# EAGLE design board-cube (EAGLE 6.6.0)
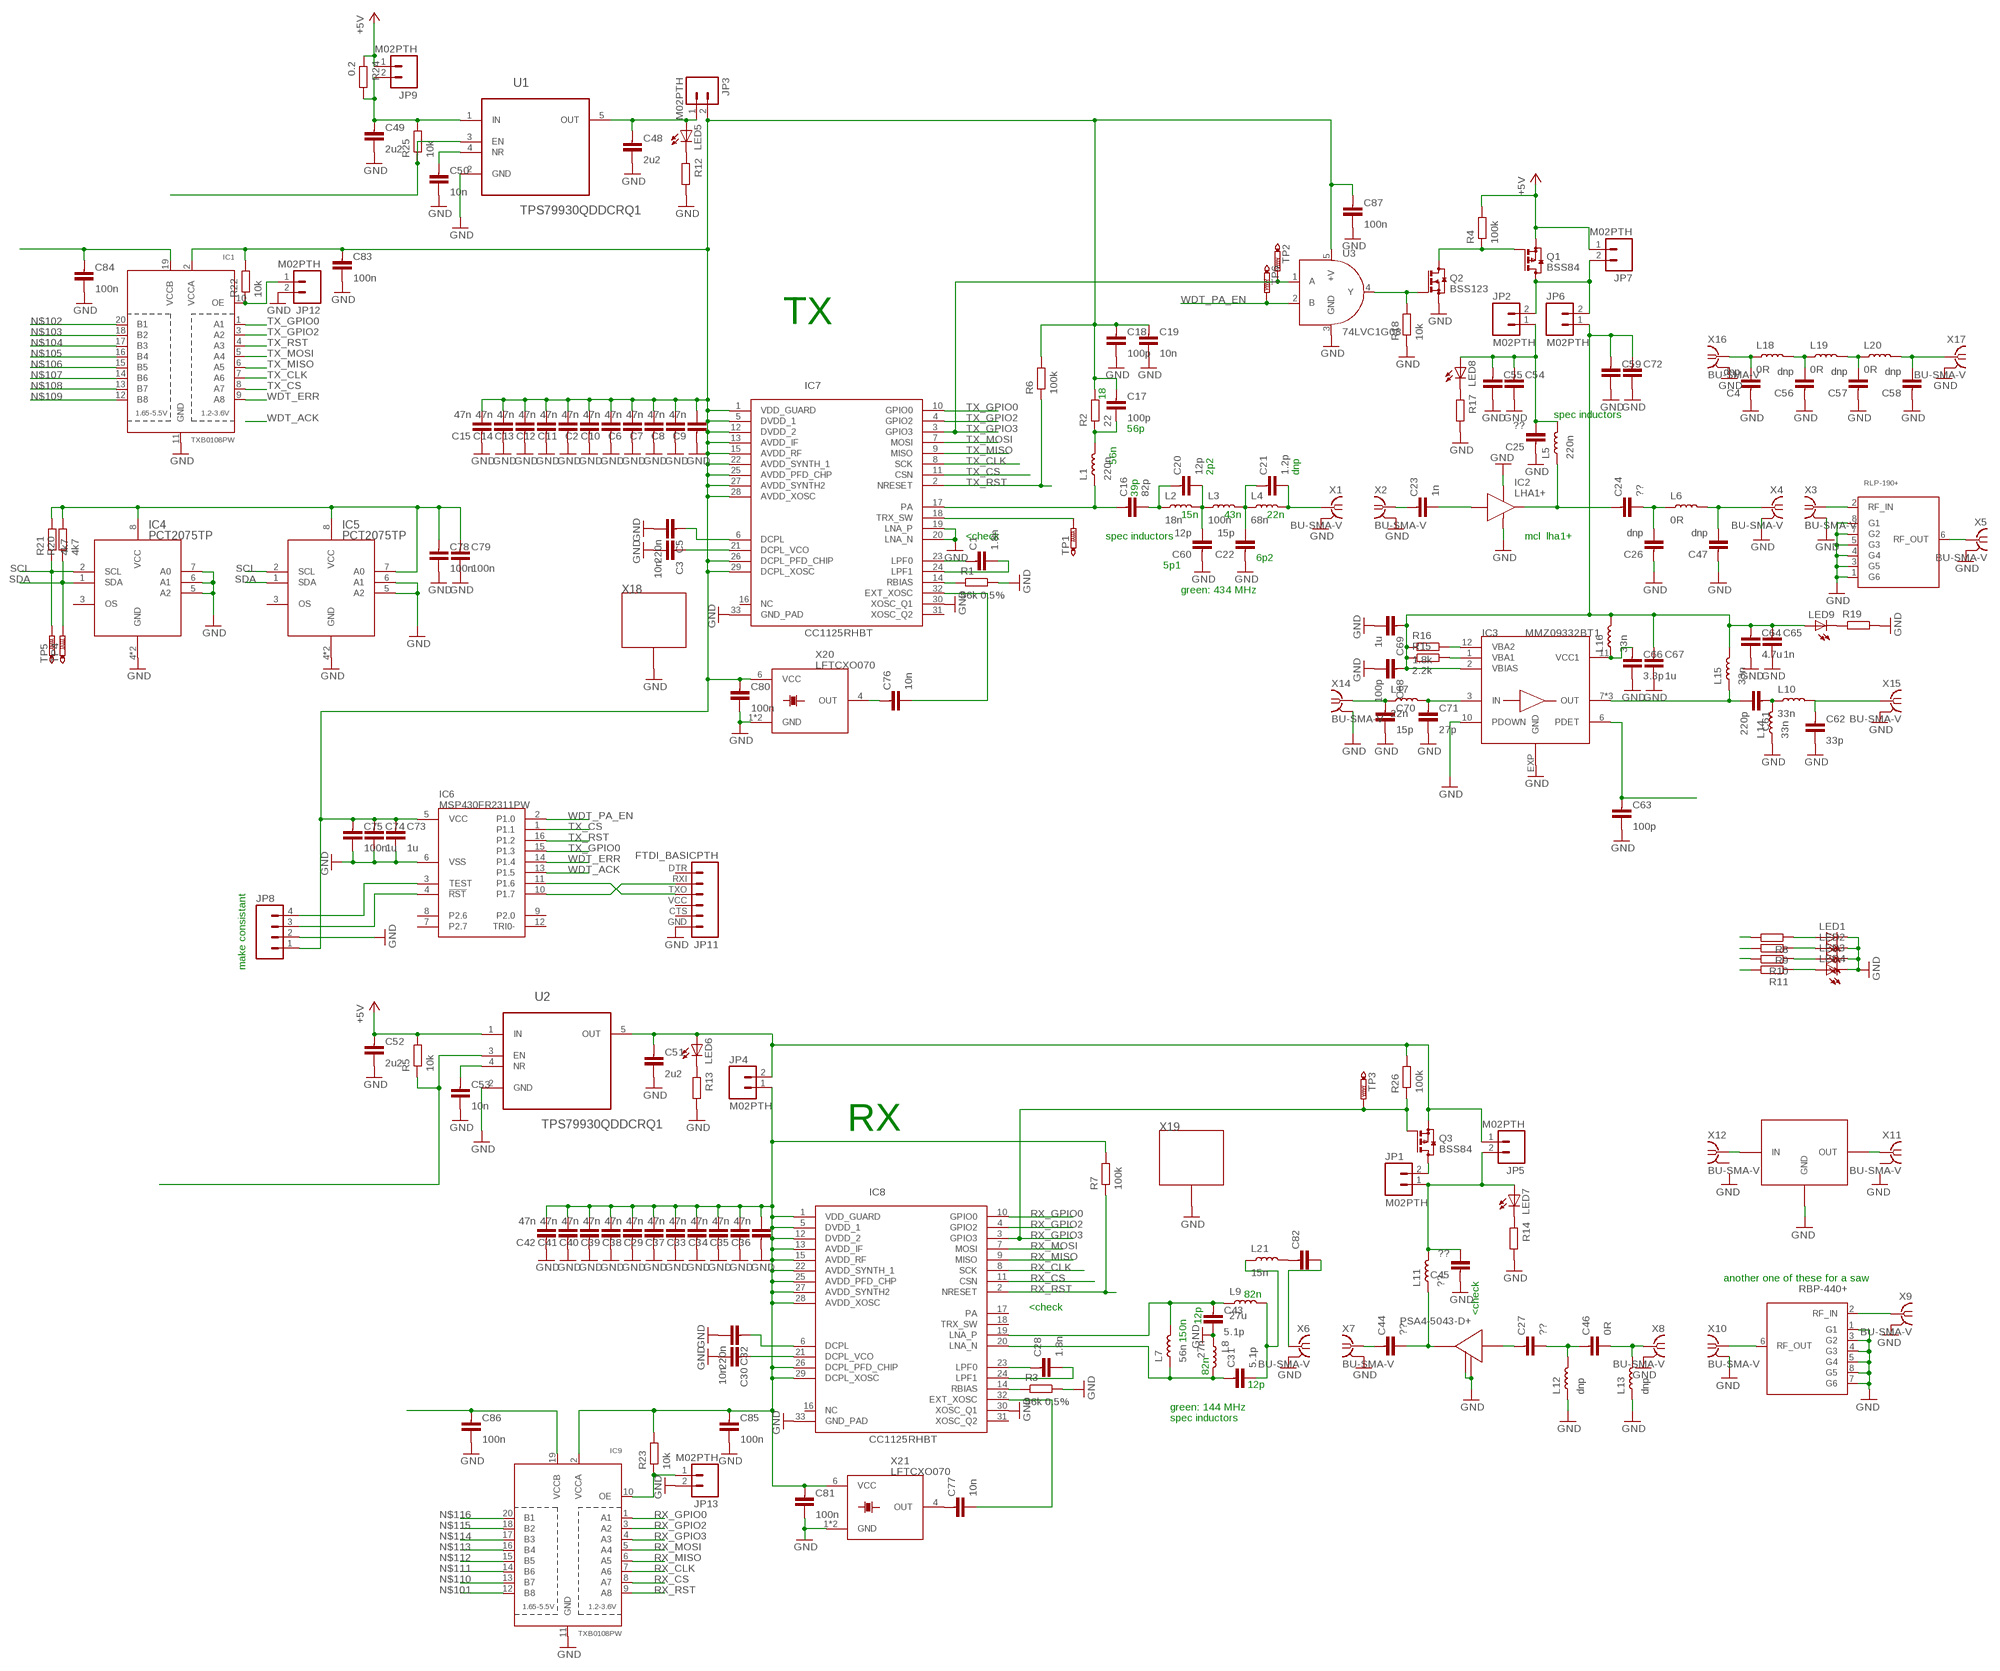
[diagram p0: schematic, sheet 1]

## Parts
C1  1.8n  CAPACITOR0603-N  [C0603-N]
C2  47n  CAPACITOR0603-N  [C0603-N]
C3  10n  CAPACITOR0603-N  [C0603-N]
C4  dnp  CAPACITOR0603-N  [C0603-N]
C5  220n  CAPACITOR0603-N  [C0603-N]
C6  47n  CAPACITOR0603-N  [C0603-N]
C7  47n  CAPACITOR0603-N  [C0603-N]
C8  47n  CAPACITOR0603-N  [C0603-N]
C9  47n  CAPACITOR0603-N  [C0603-N]
C10  47n  CAPACITOR0603-N  [C0603-N]
C11  47n  CAPACITOR0603-N  [C0603-N]
C12  47n  CAPACITOR0603-N  [C0603-N]
C13  47n  CAPACITOR0603-N  [C0603-N]
C14  47n  CAPACITOR0603-N  [C0603-N]
C15  47n  CAPACITOR0603-N  [C0603-N]
C16  82p  CAPACITOR0603-N  [C0603-N]
C17  100p  CAPACITOR0603-N  [C0603-N]
C18  100p  CAPACITOR0603-N  [C0603-N]
C19  10n  CAPACITOR0603-N  [C0603-N]
C20  12p  CAPACITOR0603-N  [C0603-N]
C21  1.2p  CAPACITOR0603-N  [C0603-N]
C22  15p  CAPACITOR0603-N  [C0603-N]
C23  1n  CAPACITOR0603-N  [C0603-N]
C24  ??  CAPACITOR0603-N  [C0603-N]
C25  ??  CAPACITOR0603-N  [C0603-N]
C26  dnp  CAPACITOR0603-N  [C0603-N]
C27  ??  CAPACITOR0603-N  [C0603-N]
C28  1.8n  CAPACITOR0603-N  [C0603-N]
C29  47n  CAPACITOR0603-N  [C0603-N]
C30  10n  CAPACITOR0603-N  [C0603-N]
C31  5.1p  CAPACITOR0603-N  [C0603-N]
C32  220n  CAPACITOR0603-N  [C0603-N]
C33  47n  CAPACITOR0603-N  [C0603-N]
C34  47n  CAPACITOR0603-N  [C0603-N]
C35  47n  CAPACITOR0603-N  [C0603-N]
C36  47n  CAPACITOR0603-N  [C0603-N]
C37  47n  CAPACITOR0603-N  [C0603-N]
C38  47n  CAPACITOR0603-N  [C0603-N]
C39  47n  CAPACITOR0603-N  [C0603-N]
C40  47n  CAPACITOR0603-N  [C0603-N]
C41  47n  CAPACITOR0603-N  [C0603-N]
C42  47n  CAPACITOR0603-N  [C0603-N]
C43  5.1p  CAPACITOR0603-N  [C0603-N]
C44  ??  CAPACITOR0603-N  [C0603-N]
C45  ??  CAPACITOR0603-N  [C0603-N]
C46  0R  CAPACITOR0603-N  [C0603-N]
C47  dnp  CAPACITOR0603-N  [C0603-N]
C48  2u2  CAPACITOR0603-N  [C0603-N]
C49  2u2  CAPACITOR0603-N  [C0603-N]
C50  10n  CAPACITOR0603-N  [C0603-N]
C51  2u2  CAPACITOR0603-N  [C0603-N]
C52  2u2  CAPACITOR0603-N  [C0603-N]
C53  10n  CAPACITOR0603-N  [C0603-N]
C54  CAPACITOR0805-N  [C0805-N]
C55  CAPACITOR0805-N  [C0805-N]
C56  dnp  CAPACITOR0603-N  [C0603-N]
C57  dnp  CAPACITOR0603-N  [C0603-N]
C58  dnp  CAPACITOR0603-N  [C0603-N]
C59  CAPACITOR0805-N  [C0805-N]
C60  12p  CAPACITOR0603-N  [C0603-N]
C61  220p  CAPACITOR0603-N  [C0603-N]
C62  33p  CAPACITOR0603-N  [C0603-N]
C63  100p  CAPACITOR0603-N  [C0603-N]
C64  4.7u  CAPACITOR0603-N  [C0603-N]
C65  1n  CAPACITOR0603-N  [C0603-N]
C66  3.3p  CAPACITOR0603-N  [C0603-N]
C67  1u  CAPACITOR0603-N  [C0603-N]
C68  100p  CAPACITOR0603-N  [C0603-N]
C69  1u  CAPACITOR0603-N  [C0603-N]
C70  15p  CAPACITOR0603-N  [C0603-N]
C71  27p  CAPACITOR0603-N  [C0603-N]
C72  CAPACITOR0805-N  [C0805-N]
C73  1u  CAPACITOR0603-N  [C0603-N]
C74  1u  CAPACITOR0603-N  [C0603-N]
C75  100n  CAPACITOR0603-N  [C0603-N]
C76  10n  CAPACITOR0603-N  [C0603-N]
C77  10n  CAPACITOR0603-N  [C0603-N]
C78  100n  CAPACITOR0603-N  [C0603-N]
C79  100n  CAPACITOR0603-N  [C0603-N]
C80  100n  CAPACITOR0603-N  [C0603-N]
C81  100n  CAPACITOR0603-N  [C0603-N]
C82  CAPACITOR0603-N  [C0603-N]
C83  100n  CAPACITOR0603-N  [C0603-N]
C84  100n  CAPACITOR0603-N  [C0603-N]
C85  100n  CAPACITOR0603-N  [C0603-N]
C86  100n  CAPACITOR0603-N  [C0603-N]
C87  100n  CAPACITOR0603-N  [C0603-N]
FL1  LPF_CS  [PL-176]
FL2  SAW_FILTER_CS  [PL-176]
FL3  GOLLEDGE_SAW_FILTER  [GOLLEDGE_SAW]
IC1  TXB0108PW  [TSSOP20]
IC2  LHA1+  PA  [PA]
IC3  MMZ09332BT1  [QFN3X3-6]
IC4  PCT2075TP  [HWSON8]
IC5  PCT2075TP  [HWSON8]
IC6  MSP430FR2311PW  [SSOP16]
IC7  CC1125RHBT  [QFN32_5X5]
IC8  CC1125RHBT  [QFN32_5X5]
IC9  TXB0108PW  [TSSOP20]
IC10  LNA_COMMON  [LNA_MMM1362]
JP1  M02PTH  [1X02]
JP2  M02PTH  [1X02]
JP3  M02PTH  [1X02]
JP4  M02PTH  [1X02]
JP5  M02PTH  [1X02]
JP6  M02PTH  [1X02]
JP7  M02PTH  [1X02]
JP8  M04PTH  [1X04]
JP9  M02PTH  [1X02]
JP11  FTDI_BASICPTH  [FTDI_BASIC]
JP12  M02PTH  [1X02]
JP13  M02PTH  [1X02]
L1  220n  INDUCTOR0603-N  [L0603-N]
L2  18n  INDUCTOR0603-N  [L0603-N]
L3  100n  INDUCTOR0603-N  [L0603-N]
L4  68n  INDUCTOR0603-N  [L0603-N]
L5  220n  INDUCTOR0603-N  [L0603-N]
L6  0R  INDUCTOR0603-N  [L0603-N]
L7  56n  INDUCTOR0603-N  [L0603-N]
L8  27n  INDUCTOR0603-N  [L0603-N]
L9  27u  INDUCTOR0603-N  [L0603-N]
L10  33n  INDUCTOR0603-N  [L0603-N]
L11  ??  INDUCTOR0603-N  [L0603-N]
L12  dnp  INDUCTOR0603-N  [L0603-N]
L13  dnp  INDUCTOR0603-N  [L0603-N]
L14  33n  INDUCTOR0603-N  [L0603-N]
L15  33n  INDUCTOR0603-N  [L0603-N]
L16  33n  INDUCTOR0603-N  [L0603-N]
L17  22n  INDUCTOR0603-N  [L0603-N]
L18  0R  INDUCTOR0603-N  [L0603-N]
L19  0R  INDUCTOR0603-N  [L0603-N]
L20  0R  INDUCTOR0603-N  [L0603-N]
L21  15n  INDUCTOR0603-N  [L0603-N]
LED1  LEDCHIP-LED0603  [CHIP-LED0603]
LED2  LEDCHIP-LED0603  [CHIP-LED0603]
LED3  LEDCHIP-LED0603  [CHIP-LED0603]
LED4  LEDCHIP-LED0603  [CHIP-LED0603]
LED5  LEDCHIP-LED0603  [CHIP-LED0603]
LED6  LEDCHIP-LED0603  [CHIP-LED0603]
LED7  LEDCHIP-LED0603  [CHIP-LED0603]
LED8  LEDCHIP-LED0603  [CHIP-LED0603]
LED9  LEDCHIP-LED0603  [CHIP-LED0603]
Q1  BSS84  [SOT23]
Q2  BSS123  [SOT23]
Q3  BSS84  [SOT23]
R1  56k 0.5%  RESISTOR0603-N  [R0603-N]
R2  22  RESISTOR0603-N  [R0603-N]
R3  56k 0.5%  RESISTOR0603-N  [R0603-N]
R4  100k  RESISTOR0603-N  [R0603-N]
R5  10k  RESISTOR0603-N  [R0603-N]
R6  100k  RESISTOR0603-N  [R0603-N]
R7  100k  RESISTOR0603-N  [R0603-N]
R8  RESISTOR0603-N  [R0603-N]
R9  RESISTOR0603-N  [R0603-N]
R10  RESISTOR0603-N  [R0603-N]
R11  RESISTOR0603-N  [R0603-N]
R12  RESISTOR0603-N  [R0603-N]
R13  RESISTOR0603-N  [R0603-N]
R14  RESISTOR0603-N  [R0603-N]
R15  2.2k  RESISTOR0603-N  [R0603-N]
R16  1.8k  RESISTOR0603-N  [R0603-N]
R17  RESISTOR0603-N  [R0603-N]
R18  10k  RESISTOR0603-N  [R0603-N]
R19  RESISTOR0603-N  [R0603-N]
R20  4k7  RESISTOR0603-N  [R0603-N]
R21  4k7  RESISTOR0603-N  [R0603-N]
R22  10k  RESISTOR0603-N  [R0603-N]
R23  10k  RESISTOR0603-N  [R0603-N]
R24  0.2  RESISTOR0603-N  [R0603-N]
R25  10k  RESISTOR0603-N  [R0603-N]
R26  100k  RESISTOR0603-N  [R0603-N]
TP1  PTR1B1,27  [B1,27]
TP2  PTR1B1,27  [B1,27]
TP3  PTR1B1,27  [B1,27]
TP4  PTR1B1,27  [B1,27]
TP5  PTR1B1,27  [B1,27]
TP6  PTR1B1,27  [B1,27]
U1  TPS79930QDDCRQ1  TPS79933QDDCRQ1  [SOT95P280X110-5N]
U2  TPS79930QDDCRQ1  TPS79933QDDCRQ1  [SOT95P280X110-5N]
U3  74LVC1G08  SN74LVC1G08  [SOT23-5]
X1  BU-SMA-V  [BU-SMA-V]
X2  BU-SMA-V  [BU-SMA-V]
X3  BU-SMA-V  [BU-SMA-V]
X4  BU-SMA-V  [BU-SMA-V]
X5  BU-SMA-V  [BU-SMA-V]
X6  BU-SMA-V  [BU-SMA-V]
X7  BU-SMA-V  [BU-SMA-V]
X8  BU-SMA-V  [BU-SMA-V]
X9  BU-SMA-V  [BU-SMA-V]
X10  BU-SMA-V  [BU-SMA-V]
X11  BU-SMA-V  [BU-SMA-V]
X12  BU-SMA-V  [BU-SMA-V]
X14  BU-SMA-V  [BU-SMA-V]
X15  BU-SMA-V  [BU-SMA-V]
X16  BU-SMA-V  [BU-SMA-V]
X17  BU-SMA-V  [BU-SMA-V]
X18  SHIELD-26X26  [SHIELD-26X26]
X19  SHIELD-26X26  [SHIELD-26X26]
X20  LFTCXO070  [260-SERIES]
X21  LFTCXO070  [260-SERIES]

## Nets
+5V: C52.1 JP7.1 JP9.1 Q1.2(S) R4.2 R5.2 R24.1 U2.1(IN)
GND: C2.1 C3.2 C4.1 C5.2 C6.1 C7.1 C8.1 C9.1 C10.1 C11.1 C12.1 C13.1 C14.1 C15.1 C18.2 C19.2 C22.1 C25.1 C26.1 C29.1 C30.2 C32.2 C33.1 C34.1 C35.1 C36.1 C37.1 C38.1 C39.1 C40.1 C41.1 C42.1 C43.2 C45.1 C47.1 C48.2 C49.2 C50.2 C51.2 C52.2 C53.2 C54.2 C55.2 C56.1 C57.1 C58.1 C59.2 C60.1 C62.2 C63.2 C64.2 C65.2 C66.2 C67.2 C68.2 C69.2 C70.2 C71.2 C72.2 C73.2 C74.2 C75.2 C78.2 C79.2 C80.2 C81.2 C83.2 C84.2 C85.2 C86.2 C87.2 FL1.1(G6) FL1.3(G5) FL1.4(G4) FL1.5(G3) FL1.7(G2) FL1.8(G1) FL2.1(G1) FL2.3(G2) FL2.4(G3) FL2.5(G4) FL2.7(G6) FL2.8(G5) FL3.A(GND) FL3.C(GND) FL3.D(GND) FL3.F(GND) IC1.11(GND) IC2.GND1 IC2.GND2 IC3.10(PDOWN) IC3.EXP(GND) IC4.4(GND) IC4.5(A2) IC4.6(A1) IC4.7(A0) IC4.EP(GND) IC5.4(GND) IC5.5(A2) IC5.6(A1) IC5.EP(GND) IC6.6(VSS) IC7.19(LNA_P) IC7.20(LNA_N) IC7.30(XOSC_Q1) IC7.33(GND_PAD) IC8.30(XOSC_Q1) IC8.33(GND_PAD) IC9.11(GND) IC10.2 IC10.4 JP8.2 JP11.GND JP12.2 JP13.2 L8.1 L12.1 L13.1 L14.1 LED1.C LED2.C LED3.C LED4.C Q2.2(S) R1.2 R3.2 R12.2 R13.2 R14.2 R17.2 R18.1 R19.2 U1.2(GND) U2.2(GND) U3.3(GND) X1.2 X1.3 X1.4 X1.5 X2.2 X2.3 X2.4 X2.5 X3.2 X3.3 X3.4 X3.5 X4.2 X4.3 X4.4 X4.5 X5.2 X5.3 X5.4 X5.5 X6.2 X6.3 X6.4 X6.5 X7.2 X7.3 X7.4 X7.5 X8.2 X8.3 X8.4 X8.5 X9.2 X9.3 X9.4 X9.5 X10.2 X10.3 X10.4 X10.5 X14.2 X14.3 X14.4 X14.5 X15.2 X15.3 X15.4 X15.5 X16.2 X16.3 X16.4 X16.5 X17.2 X17.3 X17.4 X17.5 X18.G1(G) X18.G2(G) X18.G3(G) X18.G4(G) X18.G5(G) X18.G6(G) X18.G7(G) X18.G8(G) X18.G9(G) X18.G10(G) X18.G11(G) X18.G12(G) X18.G13(G) X18.G14(G) X18.G15(G) X18.G16(G) X18.G17(G) X18.G19(G) X18.G20(G) X18.G21(G) X19.G1(G) X19.G2(G) X19.G3(G) X19.G4(G) X19.G5(G) X19.G6(G) X19.G7(G) X19.G8(G) X19.G9(G) X19.G10(G) X19.G11(G) X19.G12(G) X19.G13(G) X19.G14(G) X19.G15(G) X19.G16(G) X19.G17(G) X19.G19(G) X19.G20(G) X19.G21(G) X20.1(GND) X20.3(GND) X21.1(GND) X21.3(GND)
N$1: C1.1 IC7.23(LPF0)
N$2: C1.2 IC7.24(LPF1)
N$3: C23.2 IC2.RF_IN
N$4: C3.1 IC7.21(DCPL_VCO)
N$5: C17.2 L1.2 R2.1
N$6: JP2.2 JP6.2 JP7.2 Q1.3(D)
N$7: C16.1 IC7.17(PA) L1.1
N$8: IC7.14(RBIAS) R1.1
N$9: C76.2 IC7.32(EXT_XOSC)
N$10: LED1.A R8.1
N$11: LED2.A R9.1
N$12: LED3.A R10.1
N$13: IC7.18(TRX_SW) TP1.TP
N$14: LED4.A R11.1
N$15: R11.2
N$16: C4.2 L18.1 X16.1
N$17: R10.2
N$18: C24.1 IC2.RF_OUT L5.1
N$19: C5.1 IC7.6(DCPL)
N$20: C16.2 C20.1 L2.1
N$21: C20.2 C60.2 L2.2 L3.1
N$22: C21.1 C22.2 L3.2 L4.1
N$23: C21.2 L4.2 X1.1
N$24: C59.1 C64.1 C65.1 C67.1 C68.1 C69.1 C72.1 IC3.2(VBIAS) JP6.1 L15.2 L16.2 LED9.A R15.1 R16.1
N$25: C24.2 C26.2 L6.1
N$26: C23.1 X2.1
N$27: C47.2 L6.2 X4.1
N$28: FL1.2(RF_IN) X3.1
N$29: FL1.6(RF_OUT) X5.1
N$30: C28.1 IC8.23(LPF0)
N$31: C28.2 IC8.24(LPF1)
N$32: C30.1 IC8.21(DCPL_VCO)
N$33: C44.1 X7.1
N$34: C44.2 IC10.1(RF_OUT) L11.1
N$35: IC8.14(RBIAS) R3.1
N$36: C77.2 IC8.32(EXT_XOSC)
N$37: R9.2
N$38: R8.2
N$39: C48.1 JP3.1 LED5.A U1.5(OUT)
N$40: LED5.C R12.1
N$41: LED6.C R13.1
N$42: LED7.C R14.1
N$43: FL3.E(OUT) X11.1
N$44: FL3.B(IN) X12.1
N$45: C32.1 IC8.6(DCPL)
N$46: C27.1 IC10.3(RF_IN)
N$47: C43.1 IC8.19(LNA_P) L7.2 L9.1
N$48: C31.1 IC8.20(LNA_N) L7.1 L8.2
N$49: C82.2 X6.1
N$50: C27.2 C46.1 L12.2
N$51: C2.2 C6.2 C7.2 C8.2 C9.2 C10.2 C11.2 C12.2 C13.2 C14.2 C15.2 C17.1 C18.1 C19.1 C73.1 C74.1 C75.1 C80.1 C83.1 C87.1 IC1.2(VCCA) IC6.5(VCC) IC7.1(VDD_GUARD) IC7.5(DVDD_1) IC7.12(DVDD_2) IC7.13(AVDD_IF) IC7.15(AVDD_RF) IC7.22(AVDD_SYNTH_1) IC7.25(AVDD_PFD_CHP) IC7.26(DCPL_PFD_CHIP) IC7.27(AVDD_SYNTH2) IC7.28(AVDD_XOSC) IC7.29(DCPL_XOSC) JP3.2 JP8.1 R2.2 R6.2 R22.2 U3.5(+V) X20.6(VCC)
N$52: C45.2 JP1.1 JP5.2 L11.2 LED7.A
N$53: JP4.2 JP5.1 LED6.A Q3.2(S) R26.2
N$54: C46.2 L13.2 X8.1
N$55: FL2.2(RF_IN) X9.1
N$56: FL2.6(RF_OUT) X10.1
N$57: C50.1 U1.4(NR)
N$58: C61.1 L10.1 L14.2
N$59: C51.1 U2.5(OUT)
N$60: C53.1 U2.4(NR)
N$61: R5.1 U2.3(EN)
N$62: Q1.1(G) Q2.3(D) R4.1
N$63: C29.2 C33.2 C34.2 C35.2 C36.2 C37.2 C38.2 C39.2 C40.2 C41.2 C42.2 C81.1 C85.1 IC8.1(VDD_GUARD) IC8.5(DVDD_1) IC8.12(DVDD_2) IC8.13(AVDD_IF) IC8.15(AVDD_RF) IC8.22(AVDD_SYNTH_1) IC8.25(AVDD_PFD_CHP) IC8.26(DCPL_PFD_CHIP) IC8.27(AVDD_SYNTH2) IC8.28(AVDD_XOSC) IC8.29(DCPL_XOSC) IC9.2(VCCA) JP4.1 R7.2 R23.2 X21.6(VCC)
N$64: C61.2 IC3.7(OUT) IC3.8(OUT) IC3.9(OUT) L15.1
N$65: C62.1 L10.2 X15.1
N$66: C63.1 IC3.6(PDET)
N$67: LED8.C R17.1
N$68: C66.1 IC3.11(VCC1) L16.1
N$69: C49.1 JP9.2 R24.2 R25.2 U1.1(IN)
N$70: IC3.12(VBA2) R16.2
N$71: IC3.1(VBA1) R15.2
N$72: LED9.C R19.1
N$73: C70.1 L17.1 X14.1
N$74: C71.1 IC3.3(IN) L17.2
N$75: JP1.2 Q3.3(D)
N$76: C56.2 L18.2 L19.1
N$77: C57.2 L19.2 L20.1
N$78: C58.2 L20.2 X17.1
N$79: C25.2 C54.1 C55.1 JP2.1 L5.2 LED8.A
N$80: IC1.10(OE) JP12.1 R22.1
N$81: C76.1 X20.4(OUT)
N$82: C77.1 X21.4(OUT)
N$83: IC6.3(TEST) JP8.4
N$84: IC6.4(!RST) JP8.3
N$85: IC6.11(P1.6) JP11.TXO
N$86: C78.1 C79.1 IC4.8(VCC) IC5.7(A0) IC5.8(VCC) R20.2 R21.2
N$87: IC6.10(P1.7) JP11.RXI
N$88: C82.1 L21.2
N$90: C31.2 L9.2 L21.1
N$91: IC9.10(OE) JP13.1 R23.1
N$92: C84.1 IC1.19(VCCB)
N$93: C86.1 IC9.19(VCCB)
N$94: R25.1 U1.3(EN)
N$101: IC9.12(B8)
N$102: IC1.20(B1)
N$103: IC1.18(B2)
N$104: IC1.17(B3)
N$105: IC1.16(B4)
N$106: IC1.15(B5)
N$107: IC1.14(B6)
N$108: IC1.13(B7)
N$109: IC1.12(B8)
N$110: IC9.13(B7)
N$111: IC9.14(B6)
N$112: IC9.15(B5)
N$113: IC9.16(B4)
N$114: IC9.17(B3)
N$115: IC9.18(B2)
N$116: IC9.20(B1)
N$117: Q2.1(G) R18.2 U3.4(Y)
RX_CLK: IC8.8(SCK) IC9.7(A6)
RX_CS: IC8.11(CSN) IC9.8(A7)
RX_GPIO0: IC8.10(GPIO0) IC9.1(A1)
RX_GPIO2: IC8.4(GPIO2) IC9.3(A2)
RX_GPIO3: IC8.3(GPIO3) IC9.4(A3) Q3.1(G) R26.1 TP3.TP
RX_MISO: IC8.9(MISO) IC9.6(A5)
RX_MOSI: IC8.7(MOSI) IC9.5(A4)
RX_RST: IC8.2(NRESET) IC9.9(A8) R7.1
SCL: IC4.2(SCL) IC5.2(SCL) R21.1 TP5.TP
SDA: IC4.1(SDA) IC5.1(SDA) R20.1 TP4.TP
TX_CLK: IC1.7(A6) IC7.8(SCK)
TX_CS: IC1.8(A7) IC6.1(P1.1) IC7.11(CSN)
TX_GPIO0: IC1.1(A1) IC6.15(P1.3) IC7.10(GPIO0)
TX_GPIO2: IC1.3(A2) IC7.4(GPIO2)
TX_GPIO3: IC7.3(GPIO3) TP2.TP U3.1(A)
TX_MISO: IC1.6(A5) IC7.9(MISO)
TX_MOSI: IC1.5(A4) IC7.7(MOSI)
TX_RST: IC1.4(A3) IC6.16(P1.2) IC7.2(NRESET) R6.1
WDT_ACK: IC6.13(P1.5)
WDT_ERR: IC1.9(A8) IC6.14(P1.4)
WDT_PA_EN: IC6.2(P1.0) TP6.TP U3.2(B)
Unconnected: IC4.3(OS) IC5.3(OS) IC6.7(P2.7) IC6.8(P2.6) IC6.9(P2.0) IC6.12(TRI0-) IC7.16(NC) IC7.31(XOSC_Q2) IC8.16(NC) IC8.17(PA) IC8.18(TRX_SW) IC8.31(XOSC_Q2) JP11.CTS JP11.DTR JP11.VCC X11.2 X11.3 X11.4 X11.5 X12.2 X12.3 X12.4 X12.5

## Notes on the sheet
- TX
- 18
- spec inductors
- 56p
- 56n
- 2p2 | dnp
- 39p
- 15n | 43n | 22n
- <check | spec inductors | mcl  lha1+
- 5p1 | 6p2
- green: 434 MHz
- make consistant
- RX
- <check | another one of these for a saw
- 82n
- <check
- 12p
- 150n
- 82n
- 12p
- green: 144 MHz
- spec inductors

## Library data of the parts
C1-C87 = passives-7351:CAPACITOR
FL1 = CubeSat3:LPF_CS
FL2 = CubeSat3:SAW_FILTER_CS
FL3 = Ava:GOLLEDGE_SAW_FILTER
IC1 IC9 = cube-parts:TXB0108
IC2 = CubeSat3:PA
IC3 = CubeSat3:MMZ09332BT1
IC4 IC5 = CubeSat3:PCT2075; FARNELL: 2396745
IC6 = CubeSat3:MSP430FR2311
IC7 IC8 = cube-parts:CC1125RHBT; FARNELL_OC: 2422924
IC10 = CubeSat3:LNA_COMMON
JP1-JP7 JP9 JP12 JP13 = SparkFun-Connectors:M02: Standard 2-pin 0.1" header. Use with - straight break away headers ( PRT-00116) - right angle break away headers (PRT-00553) - swiss pins (PRT-00743) - machine pins (PRT-00117) - female headers (PRT-00115) Molex polarized connector foot print use with: PRT-08233 with associated crimp pins and housings. 2.54_SCREWTERM for use with PRT-10571. 3.5mm Screw Terminal footprints for PRT-08084 5mm Screw Terminal footprints for use with PRT-08432
JP8 = SparkFun-Connectors:M04: Header 4 Standard 4-pin 0.1" header. Use with straight break away headers (SKU : PRT-00116), right angle break away headers (PRT-00553), swiss pins (PRT-00743), machine pins (PRT-00117), and female headers (PRT-00115). Molex polarized connector foot print use with SKU : PRT-08231 with associated crimp pins and housings. 1MM SMD Version SKU: PRT-10208
JP11 = SparkFun-Connectors:FTDI_BASIC: FTDI Basic header with labels
L1-L21 = passives-7351:INDUCTOR
LED1-LED9 = dtb:LED: LED OSRAM: - CHIPLED LG R971, LG N971, LY N971, LG Q971, LY Q971, LO R971, LY R971 LH N974, LH R974 LS Q976, LO Q976, LY Q976 LO Q996 - Hyper CHIPLED LW Q18S LB Q993, LB Q99A, LB R99A - SideLED LS A670, LO A670, LY A670, LG A670, LP A670 LB A673, LV A673, LT A673, LW A673 LH A674 LY A675 LS A676, LA A676, LO A676, LY A676, LW A676 LS A679, LY A679, LG A679 - Hyper Micro SIDELED® LS Y876, LA Y876, LO Y876, LY Y876 LT Y87S - SmartLED LW L88C, LW L88S LB L89C, LB L89S, LG L890 LS L89K, LO L89K, LY L89K LS L896, LA L896, LO L896, LY L896 - TOPLED LS T670, LO T670, LY T670, LG T670, LP T670 LSG T670, LSP T670, LSY T670, LOP T670, LYG T670 LG T671, LOG T671, LSG T671 LB T673, LV T673, LT T673, LW T673 LH T674 LS T676, LA T676, LO T676, LY T676, LB T676, LH T676, LSB T676, LW T676 LB T67C, LV T67C, LT T67C, LS T67K, LO T67K, LY T67K, LW E67C LS E67B, LA E67B, LO E67B, LY E67B, LB E67C, LV E67C, LT E67C LW T67C LS T679, LY T679, LG T679 LS T770, LO T770, LY T770, LG T770, LP T770 LB T773, LV T773, LT T773, LW T773 LH T774 LS E675, LA E675, LY E675, LS T675 LS T776, LA T776, LO T776, LY T776, LB T776 LHGB T686 LT T68C, LB T68C - Hyper Mini TOPLED® LB M676 - Mini TOPLED Santana® LG M470 LS M47K, LO M47K, LY M47K Source: http://www.osram.convergy.de LUXEON: - LUMILED® LXK2-PW12-R00, LXK2-PW12-S00, LXK2-PW14-U00, LXK2-PW14-V00 LXK2-PM12-R00, LXK2-PM12-S00, LXK2-PM14-U00 LXK2-PE12-Q00, LXK2-PE12-R00, LXK2-PE12-S00, LXK2-PE14-T00, LXK2-PE14-U00 LXK2-PB12-K00, LXK2-PB12-L00, LXK2-PB12-M00, LXK2-PB14-N00, LXK2-PB14-P00, LXK2-PB14-Q00 LXK2-PR12-L00, LXK2-PR12-M00, LXK2-PR14-Q00, LXK2-PR14-R00 LXK2-PD12-Q00, LXK2-PD12-R00, LXK2-PD12-S00 LXK2-PH12-R00, LXK2-PH12-S00 LXK2-PL12-P00, LXK2-PL12-Q00, LXK2-PL12-R00 Source: www.luxeon.com KINGBRIGHT: KA-3528ASYC Source: www.kingbright.com
Q1 Q3 = transistor-small-signal:BSS84: P-CHANNEL MOS FET
Q2 = transistor-small-signal:BSS123: N-CHANNEL MOS FET
R1-R26 = passives-7351:RESISTOR
TP1-TP6 = testpad:PTR1: TEST PIN
U1 U2 = cube-parts:TPS79933QDDCRQ1: LINEAR REGULATOR; MPN: TPS79933QDDCRQ1; OC_FARNELL: -; OC_NEWARK: 25R0151; PACKAGE: SOT-5; SUPPLIER: Texas Instruments
U3 = SparkFun-DigitalIC:SN74LVC1G08: Single-gate AND logic; PROD_ID: 10841
X1-X12 X14-X17 = con-coax:BU-SMA-V: FEMALE SMA CONNECTOR Radiall distributor RS 112-3794; OC_FARNELL: unknown; OC_NEWARK: unknown
X18 X19 = CubeSat3:SHIELD; FARNELL: 2497719/2497718
X20 X21 = CubeSat3:LFTCXO070

## Board
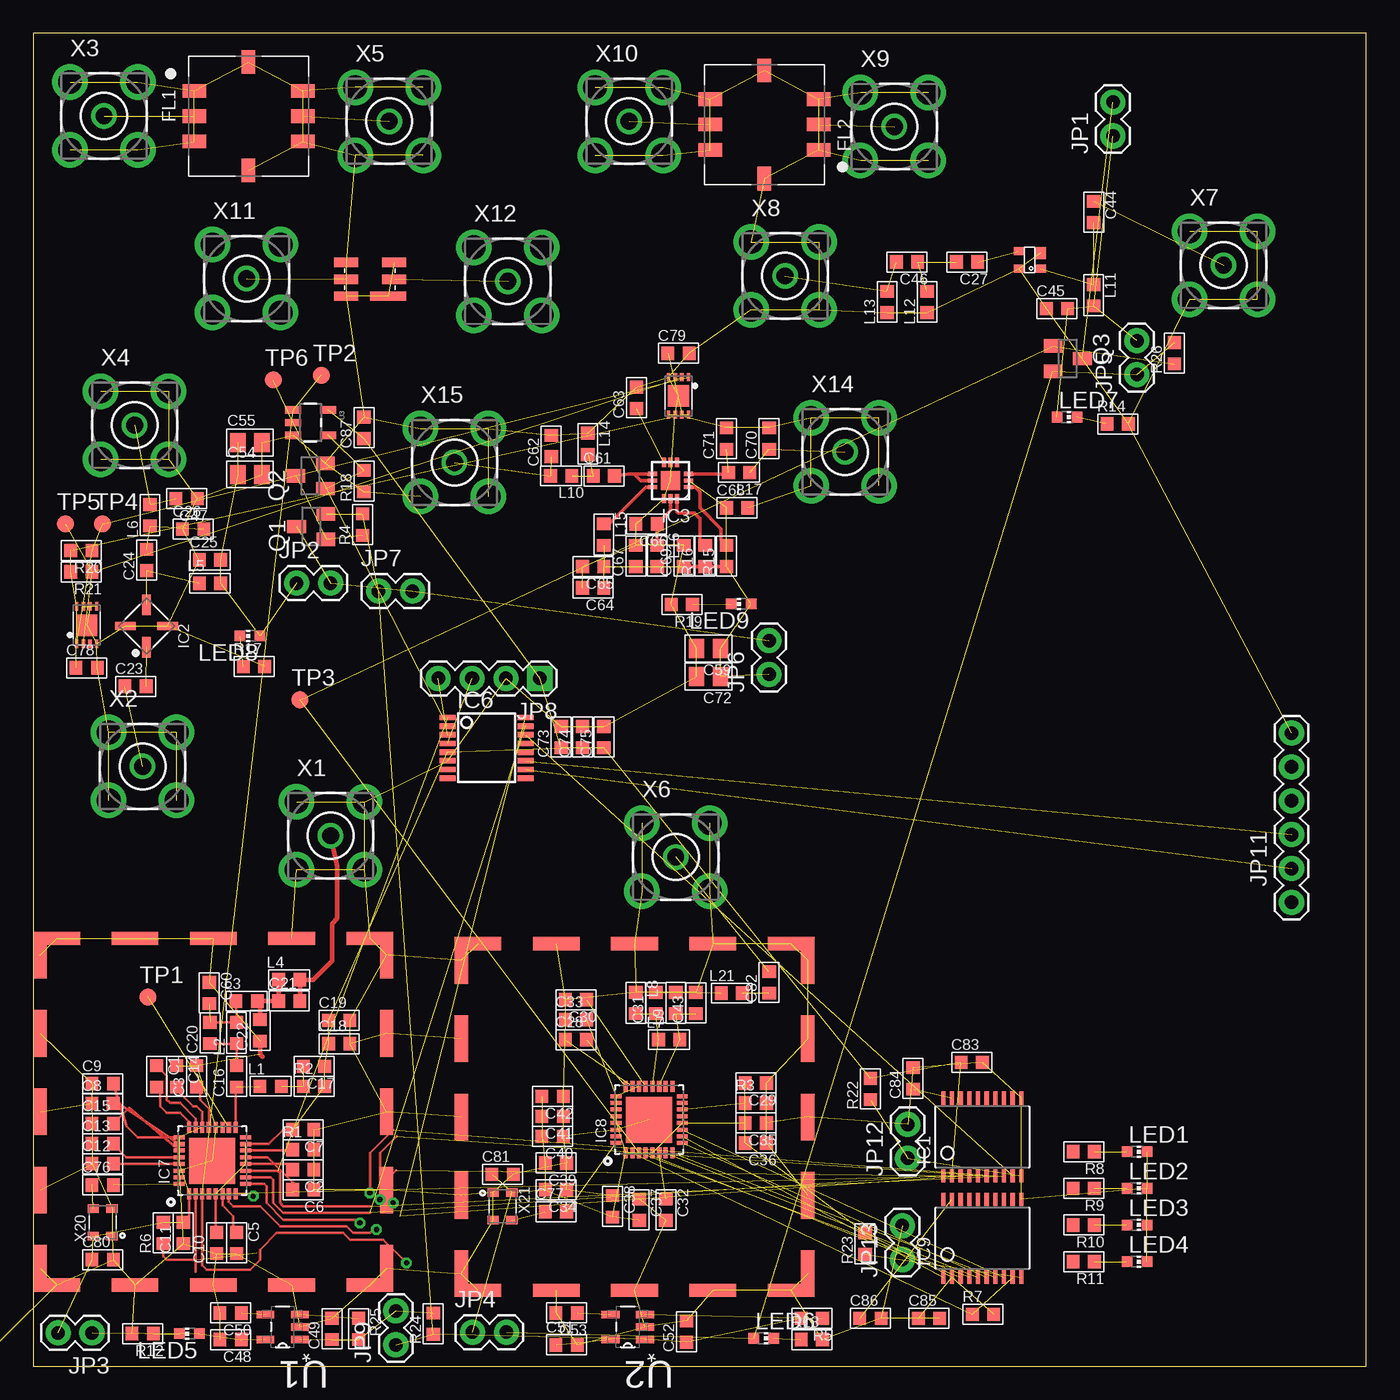
[diagram p1: board, top side]
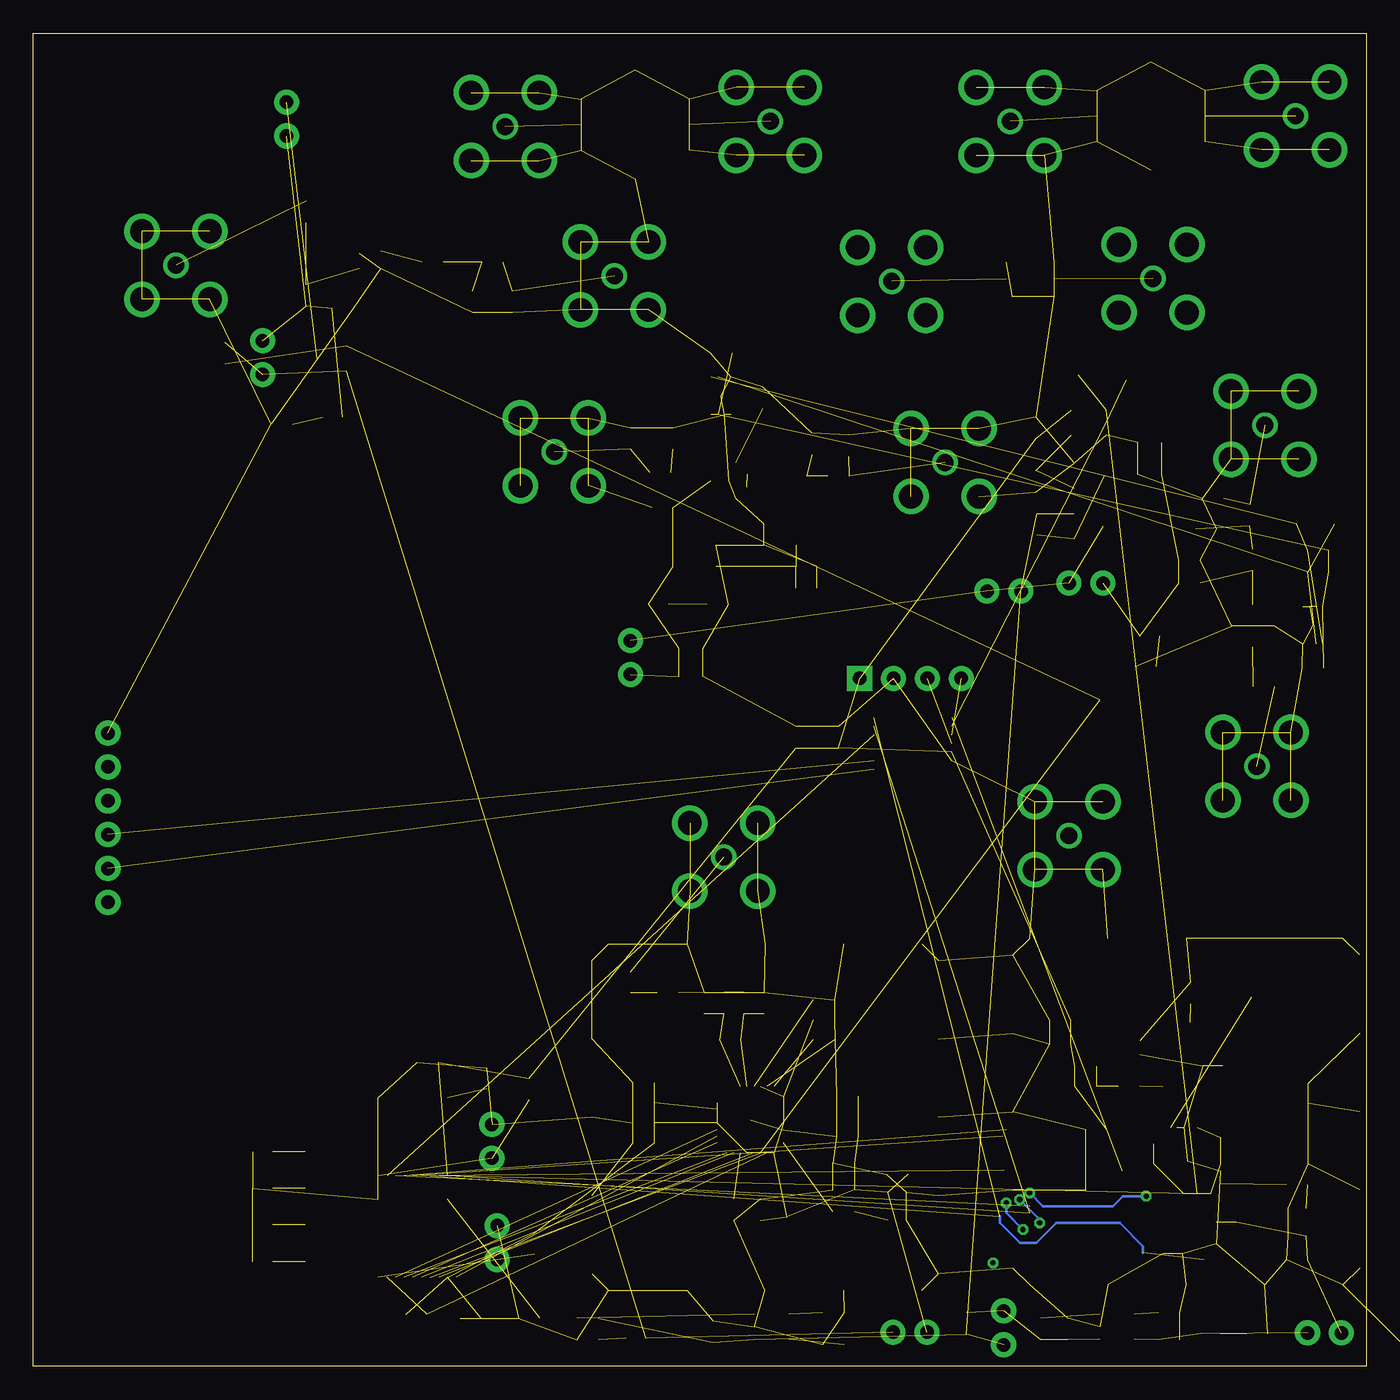
[diagram p2: board, bottom side, seen from below]

Size 100 x 100 mm. Coordinates in mm from the lower left corner, seen from the top.
Outline: 0,0 100,0 100,100 0,100 0,0
Copper layers ((1*2)+(15*16)): Top 0.035mm / dielectric 0.15mm / Route2 0.035mm / dielectric 1.5mm / Route15 0.035mm / dielectric 0.2mm / Bottom 0.035mm
Design rules "default *": minimum track width 10mil, minimum drill 24mil, track to track 8mil, track to pad 8mil, pad to pad 8mil, via to via 8mil, smd to smd 8mil, copper to edge 40mil, drill to drill 8mil, minimum pad ring 10mil, minimum via ring 8mil, stop-mask expansion 4mil, vias tented up to drill 0mil, thermal gap 10mil

### Footprints (pad centres in the part's own frame; a part is rotated, then mirrored left to right if it is on the bottom)
C0603-N = smd 0.95 x 1: 1 -0.8,0; 2 0.8,0
C0805-N = smd 1.15 x 1.45: 1 -0.9,0; 2 0.9,0
PL-176 = smd 1.016 x 1.778: 1 -1.905,-4.064; 2 0,-4.064; 3 1.905,-4.064; 5 1.905,4.064; 6 0,4.064; 7 -1.905,4.064 | smd 1.778 x 1.016: 4 4.064,0; 8 -4.064,0
GOLLEDGE_SAW = smd 2.7 x 0.7: A 1.35,-1.27 | smd 1.8 x 0.7: B 1.8,0; C 1.8,1.27; D -1.8,1.27; E -1.8,0; F -1.8,-1.27
TSSOP20 = smd 0.305 x 0.991: 1 -2.925,-2.918; 2 -2.275,-2.918; 3 -1.625,-2.918; 4 -0.975,-2.918; 5 -0.325,-2.918; 6 0.325,-2.918; 7 0.975,-2.918; 8 1.625,-2.918; 9 2.275,-2.918; 10 2.925,-2.918; 11 2.925,2.918; 12 2.275,2.918; 13 1.625,2.918; 14 0.975,2.918; 15 0.325,2.918; 16 -0.325,2.918; 17 -0.975,2.918; 18 -1.625,2.918; 19 -2.275,2.918; 20 -2.925,2.918
PA = smd 1.55 x 0.61: GND1 -1.59,0; GND2 1.59,0 | smd 0.61 x 1.55: RF_IN 0,-1.59; RF_OUT 0,1.59
QFN3X3-6 = smd 0.7 x 0.3: 1 -1.35,0.5; 2 -1.35,0; 3 -1.35,-0.5; 7 1.35,-0.5; 8 1.35,0; 9 1.35,0.5 | smd 0.3 x 0.7: 4 -0.5,-1.35; 5 0,-1.35; 6 0.5,-1.35; 10 0.5,1.35; 11 0,1.35; 12 -0.5,1.35 | smd 1.45 x 1.45: EXP 0,0
HWSON8 = smd 0.25 x 0.625: 1 -0.75,-1.41; 2 -0.25,-1.41; 3 0.25,-1.41; 4 0.75,-1.41; 5 0.75,1.41; 6 0.25,1.41; 7 -0.25,1.41; 8 -0.75,1.41 | smd 1.6 x 1.6: EP 0,0
SSOP16 = smd 0.4 x 1.2: 1 -2.275,-2.925; 2 -1.625,-2.925; 3 -0.975,-2.925; 4 -0.325,-2.925; 5 0.325,-2.925; 6 0.975,-2.925; 7 1.625,-2.925; 8 2.275,-2.925; 9 2.275,2.925; 10 1.625,2.925; 11 0.975,2.925; 12 0.325,2.925; 13 -0.325,2.925; 14 -0.975,2.925; 15 -1.625,2.925; 16 -2.275,2.925
QFN32_5X5 = smd 0.813 x 0.305: 1 -2.489,1.753; 2 -2.489,1.245; 3 -2.489,0.762; 4 -2.489,0.254; 5 -2.489,-0.254; 6 -2.489,-0.762; 7 -2.489,-1.245; 8 -2.489,-1.753; 17 2.489,-1.753; 18 2.489,-1.245; 19 2.489,-0.762; 20 2.489,-0.254; 21 2.489,0.254; 22 2.489,0.762; 23 2.489,1.245; 24 2.489,1.753 | smd 0.305 x 0.813: 9 -1.753,-2.489; 10 -1.245,-2.489; 11 -0.762,-2.489; 12 -0.254,-2.489; 13 0.254,-2.489; 14 0.762,-2.489; 15 1.245,-2.489; 16 1.753,-2.489; 25 1.753,2.489; 26 1.245,2.489; 27 0.762,2.489; 28 0.254,2.489; 29 -0.254,2.489; 30 -0.762,2.489; 31 -1.245,2.489; 32 -1.753,2.489 | smd 3.45 x 3.45: 33 0,0
LNA_MMM1362 = smd 0.6 x 0.8: 1 0,0; 3 1.3,1.6; 4 0,1.6 | smd 0.9 x 0.8: 2 1.15,0
1X02 = drill 1.016 pad 1.88: 1 0,0; 2 2.54,0
1X04 = drill 1.016 pad 1.88 square: 1 0,0 | drill 1.016 pad 1.88: 2 2.54,0; 3 5.08,0; 4 7.62,0
FTDI_BASIC = drill 1.016 pad 1.88: CTS 10.16,0; DTR 0,0; GND 12.7,0; RXI 2.54,0; TXO 5.08,0; VCC 7.62,0
L0603-N = smd 0.95 x 1: 1 -0.8,0; 2 0.8,0
CHIP-LED0603 = smd 0.8 x 0.8: A 0,-0.75; C 0,0.75
SOT23 = smd 1 x 1.4: 1 -0.95,-1.1; 2 0.95,-1.1; 3 0,1.1
R0603-N = smd 0.95 x 1: 1 -0.8,0; 2 0.8,0
B1,27 = smd 1.27 x 1.27: TP 0,0
SOT95P280X110-5N = smd 1.321 x 0.559: 1 -1.295,0.94; 2 -1.295,0; 3 -1.295,-0.94; 4 1.295,-0.94; 5 1.295,0.94
SOT23-5 = smd 0.55 x 1.2: 1 -0.95,-1.3; 2 0,-1.3; 3 0.95,-1.3; 4 0.95,1.3; 5 -0.95,1.3
BU-SMA-V = drill 1.27: 1 0,0 | drill 1.778: 2 -2.55,2.55; 3 2.55,2.55; 4 2.55,-2.55; 5 -2.55,-2.55
SHIELD-26X26 = smd 3.5 x 1: G1 1.75,0.5; G7 25.25,26.5; G8 1.75,26.5; G9 13.5,26.5; G10 7.625,26.5; G11 19.375,26.5; G17 25.25,0.5; G19 13.5,0.5; G20 7.625,0.5; G21 19.375,0.5 | smd 1 x 3.5: G2 0.5,1.75; G3 0.5,25.25; G4 0.5,13.5; G5 0.5,19.375; G6 0.5,7.625; G12 26.5,1.75; G13 26.5,25.25; G14 26.5,13.5; G15 26.5,19.375; G16 26.5,7.625
260-SERIES = smd 0.63 x 0.84: 1 -1.04,-0.7; 3 1.04,-0.7; 4 1.04,0.7; 6 -1.04,0.7

### Placement (x,y rotation side)
C1  9.25,21.75 270 top
C2  20.25,14.75 180 top
C3  12.25,21.75 90 top
C4  -294.25,-294.25 0 top  (outside the outline)
C5  15.25,9.25 270 top
C6  20.25,13.25 180 top
C7  20.25,17.75 180 top
C8  5.19,19.72 0 top
C9  5.2,21.2 0 top
C10  13.75,9.25 90 top
C11  11.25,10 90 top
C12  5.2,15.2 0 top
C13  5.2,16.7 0 top
C14  10.75,21.75 270 top
C15  5.2,18.2 0 top
C16  15.25,21.75 90 top
C17  21.05,22.5 180 top
C18  22.95,24.2 0 top
C19  22.95,25.95 0 top
C20  13.25,25 90 top
C21  19.2,27.4 0 top
C22  17,25.2 90 top
C23  7.67,51.01 0 top
C24  8.5,60.5 90 top
C25  13.25,60.5 0 top
C26  11.99,62.81 0 top
C27  70.05,82.85 180 top
C28  40.7,24.5 0 top
C29  54.2,21.25 180 top
C30  40.7,27.5 180 top
C31  46.7,27.25 90 top
C32  47.45,11.75 270 top
C33  40.7,26 0 top
C34  39.2,13.25 180 top
C35  54.2,18.25 180 top
C36  54.2,16.75 180 top
C37  45.45,11.75 270 top
C38  43.45,12 270 top
C39  39.2,15.25 180 top
C40  38.95,17.25 180 top
C41  38.95,18.75 180 top
C42  38.95,20.25 180 top
C43  49.7,27.25 90 top
C44  79.55,86.6 270 top
C45  76.8,79.35 0 top
C46  65.55,82.85 180 top
C47  11.5,65.1 180 top
C48  14.8,2 180 top
C49  22.4,2.8 90 top
C50  14.8,4 180 top
C51  40,1.6 0 top
C52  49,2.6 90 top
C53  40,4 180 top
C54  16.25,66.9 0 top
C55  16.25,69.3 0 top
C56  -294.25,-297.25 0 top  (outside the outline)
C57  -294.25,-300.25 0 top  (outside the outline)
C58  -294.25,-303.25 0 top  (outside the outline)
C59  50.65,53.85 180 top
C60  13.2,28 270 top
C61  42.8,66.8 0 top
C62  38.85,69.05 90 top
C63  45.25,72.65 90 top
C64  42,58.4 180 top
C65  42,60 180 top
C66  46,63.2 180 top
C67  45.2,60.8 90 top
C68  52.8,64.4 0 top
C69  48.8,60.8 90 top
C70  55.2,69.6 90 top
C71  52,69.6 90 top
C72  50.65,51.75 180 top
C73  39.6,47.2 90 top
C74  41.2,47.2 90 top
C75  42.8,47.2 90 top
C76  5.2,13.6 0 top
C77  39.2,11.6 0 top
C78  4,52.4 0 top
C79  48.4,76 0 top
C80  5.2,8 0 top
C81  35.2,14.4 0 top
C82  55.2,28.8 90 top
C83  70.4,22.8 0 top
C84  66,21.6 90 top
C85  67.2,3.6 0 top
C86  62.8,3.6 0 top
C87  24.8,70.4 90 top
FL1  16.15,93.78 270 top
FL2  54.85,93.15 90 top
FL3  25.25,81.55 0 top
IC1  71.2,17.2 0 top
IC2  8.49,55.54 0 top
IC3  47.8,66.45 180 top
IC4  4,55.6 0 top
IC5  48.4,72.8 180 top
IC6  34,46.4 270 top
IC7  13.43,15.42 90 top
IC8  46.2,18.5 90 top
IC9  71.2,9.6 0 top
IC10  75.55,82.35 90 top
JP1  81,92.3 90 top
JP2  19.75,58.75 0 top
JP3  4.4,2.5 180 top
JP4  32.95,2.55 0 top
JP5  82.8,74.4 90 top
JP6  55.2,51.9 90 top
JP7  25.9,58.15 0 top
JP8  38,51.6 180 top
JP9  27.2,1.6 90 top
JP11  94.4,34.8 90 top
JP12  65.6,15.6 90 top
JP13  65.2,8 90 top
L1  17.8,21 0 top
L2  15.25,25 90 top
L3  16,27.4 0 top
L4  19.2,29 0 top
L5  13.25,58.75 0 top
L6  8.75,63.85 90 top
L7  47.7,24.5 0 top
L8  45.2,27.25 270 top
L9  48.2,27.25 90 top
L10  39.6,66.8 180 top
L11  79.55,80.35 270 top
L12  67.05,79.85 90 top
L13  64.05,79.85 90 top
L14  41.6,69.2 270 top
L15  42.8,62.4 270 top
L16  46.8,60.8 270 top
L17  52.95,67.05 180 top
L18  -294.25,-285.25 0 top  (outside the outline)
L19  -294.25,-288.25 0 top  (outside the outline)
L20  -294.25,-291.25 0 top  (outside the outline)
L21  52.4,28 0 top
LED1  82.8,16.1 270 top
LED2  82.8,13.35 270 top
LED3  82.8,10.6 270 top
LED4  82.8,7.85 270 top
LED5  11.7,2.45 90 top
LED6  54.8,2.1 270 top
LED7  77.55,71.2 270 top
LED8  16.25,54.8 90 top
LED9  53.1,57.2 90 top
Q1  20.85,63 90 top
Q2  20.8,66.8 90 top
Q3  77.6,75.6 270 top
R1  20.25,16.25 0 top
R2  21.05,21 0 top
R3  54.2,19.75 0 top
R4  24.7,63.15 90 top
R5  58.4,3.6 180 top
R6  9.75,10 90 top
R7  71.25,3.9 0 top
R8  78.8,16.1 180 top
R9  78.8,13.35 180 top
R10  78.8,10.6 180 top
R11  78.8,7.85 180 top
R12  8.2,2.45 180 top
R13  58.4,2 0 top
R14  81.35,70.7 0 top
R15  52,60.8 90 top
R16  50.4,60.8 90 top
R17  16.55,52.5 0 top
R18  24.8,66.4 90 top
R19  48.65,57.15 180 top
R20  3.6,61.2 180 top
R21  3.6,59.6 180 top
R22  62.8,20.8 90 top
R23  62.4,9.2 90 top
R24  30,3.2 90 top
R25  24.4,2.8 270 top
R26  85.6,76 90 top
TP1  8.6,27.7 0 top
TP2  21.6,74.35 0 top
TP3  20,50 0 top
TP4  5.2,63.2 0 top
TP5  2.4,63.2 0 top
TP6  18,74 0 top
U1  18.7,2.95 180 top
U2  44.6,2.95 180 top
U3  20.8,70.8 270 top
X1  22.3,39.8 0 top
X2  8.2,45 0 top
X3  5.3,93.8 0 top
X4  7.6,70.6 0 top
X5  26.7,93.4 0 top
X6  48.2,38.2 0 top
X7  89.3,82.6 0 top
X8  56.4,81.8 0 top
X9  64.6,93 0 top
X10  44.7,93.4 0 top
X11  16,81.6 0 top
X12  35.6,81.4 0 top
X14  60.9,68.6 0 top
X15  31.6,67.8 0 top
X16  -284.25,-277 0 top  (outside the outline)
X17  -292.5,-277 0 top  (outside the outline)
X18  0,5.6 0 top
X19  31.6,5.2 0 top
X20  5.2,10.8 90 top
X21  35.2,12 270 top

### Tracks (layer width: path | path; a pad name or v marks a point on that pad's centre or on a via)
+5V  (7 unrouted)
GND  (234 unrouted)
  Top 0.33: C22.1 17,23.4 17.2,23.2
N$1
  Top 0.2: IC7.23 12.19,18.57 11,19.75 10.25,19.75 10,20 10,21.8 C1.1
N$2
  Top 0.2: IC7.24 11.68,18.32 11,19 10,19 9.5,19.5 9.5,20.7 C1.2
N$3  (1 unrouted)
N$4
  Top 0.2: IC7.21 13.18,19.32 12.5,20 12.5,20.7 C3.1
N$5  (2 unrouted)
N$6  (3 unrouted)
N$7  (1 unrouted)
  Top 0.2: IC7.17 15.18,20.88 C16.1
N$8
  Top 0.2: IC7.14 19.38,16.18 R1.1
N$9  (1 unrouted)
N$10  (1 unrouted)
N$11  (1 unrouted)
N$12  (1 unrouted)
N$13  (1 unrouted)
N$14  (1 unrouted)
N$16  (2 unrouted)
N$18  (2 unrouted)
N$19
  Top 0.2: IC7.6 14.19,12.06 15,11.25 15,10.3 C5.1
N$20
  Top 0.2: C16.2 L2.1 C20.1
N$21  (1 unrouted)
  Top 0.2: C20.2 L2.2 L3.1
N$22
  Top 0.33: L4.1 C21.1 L3.2 17,27.2 C22.2
N$23
  Top 0.33: C21.2 L4.2 21,29 22.4,30.4 22.4,33.2 22.8,33.6 22.8,37.5 X1.1
N$24  (11 unrouted)
  Top 0.254: R15.1 R16.1 C69.1
N$25  (2 unrouted)
N$26  (1 unrouted)
N$27  (2 unrouted)
N$28  (1 unrouted)
N$29  (1 unrouted)
N$30  (1 unrouted)
N$31  (1 unrouted)
N$32  (1 unrouted)
N$33  (1 unrouted)
N$34  (2 unrouted)
N$35  (1 unrouted)
N$36  (1 unrouted)
N$39  (3 unrouted)
N$40  (1 unrouted)
N$41  (1 unrouted)
N$42  (1 unrouted)
N$43  (1 unrouted)
N$44  (1 unrouted)
N$45  (1 unrouted)
N$46  (1 unrouted)
N$47  (3 unrouted)
N$48  (3 unrouted)
N$49  (1 unrouted)
N$50  (2 unrouted)
N$51  (28 unrouted)
  Top 0.2: IC7.25 7.83,17.17 7,18 C9.2 | IC7.26 6.13,19.86 C8.2 | IC7.27 7.18,19.38 C15.2 | IC7.28 6.97,15.67 C13.2 | IC7.29 7.97,15.17 C12.2 | IC7.12 19.03,15.17 C2.2 | C14.2 10.75,20.75 12,19.5 12.25,19.5 12.67,19.08 IC7.22 | IC7.5 13.68,10.12 C10.2 | IC7.1 11.68,11.23 C11.2 | C7.2 18.75,17.75 17.66,16.66 IC7.15 | IC7.13 17.58,15.67 19.5,13.75 19.5,13.3 C6.2
N$52  (4 unrouted)
N$53  (4 unrouted)
N$54  (2 unrouted)
N$55  (1 unrouted)
N$56  (1 unrouted)
N$57  (1 unrouted)
N$58  (2 unrouted)
N$59  (1 unrouted)
N$60  (1 unrouted)
N$61  (1 unrouted)
N$62  (2 unrouted)
N$63  (28 unrouted)
N$64  (2 unrouted)
  Top 0.254: IC3.8 45.55,66.45 45.2,66.8 | IC3.7 44.65,66.95 C61.2 | IC3.9 45.95,65.95 43.2,63.2 L15.1
N$65  (2 unrouted)
N$66  (1 unrouted)
N$67  (1 unrouted)
N$68
  Top 0.254: IC3.11 47.8,64.2 C66.1 L16.1
N$69  (4 unrouted)
N$70
  Top 0.254: IC3.12 48.3,64.1 48.4,64 49.6,64 50,63.6 50,62 R16.2
N$71
  Top 0.254: IC3.1 49.65,65.95 50,65.6 50,64.4 51.6,62.8 51.6,62 R15.2
N$72  (1 unrouted)
N$73  (2 unrouted)
N$74  (1 unrouted)
  Top 0.254: IC3.3 52.05,66.95 L17.2
N$75  (1 unrouted)
N$76  (2 unrouted)
N$77  (2 unrouted)
N$78  (2 unrouted)
N$79  (5 unrouted)
N$80  (2 unrouted)
N$81  (1 unrouted)
N$82  (1 unrouted)
N$83  (1 unrouted)
N$84  (1 unrouted)
N$85  (1 unrouted)
N$86  (6 unrouted)
N$87  (1 unrouted)
N$88  (1 unrouted)
N$90  (2 unrouted)
N$91  (2 unrouted)
N$92  (1 unrouted)
N$93  (1 unrouted)
N$94  (1 unrouted)
N$117  (2 unrouted)
RX_CLK  (1 unrouted)
RX_CS  (1 unrouted)
RX_GPIO0  (1 unrouted)
RX_GPIO2  (1 unrouted)
RX_GPIO3  (4 unrouted)
RX_MISO  (1 unrouted)
RX_MOSI  (1 unrouted)
RX_RST  (2 unrouted)
SCL  (3 unrouted)
SDA  (3 unrouted)
TX_CLK  (via drill 0.38)  (1 unrouted)
  Top 0.2: IC7.8 16.32,12.93 v16.5,12.75 | v25.25,13 25.25,16 27,17.75
  Bottom 0.2: v16.5,12.75 18.25,12.75 19,12 24.25,12 v25.25,13
TX_CS  (2 unrouted)
  Top 0.2: IC7.11 18.34,14.66 18.5,14.5 18.5,12.25 18.75,12 25.25,12
TX_GPIO0  (2 unrouted)
  Top 0.2: IC7.10 17.82,14.18 18,14 18,12.25 18.75,11.5 25.25,11.5
TX_GPIO2  (1 unrouted)
TX_GPIO3  (via drill 0.38)  (2 unrouted)
  Top 0.2: IC7.3 12.67,7.58 13,7.25 16.25,7.25 17,8 17,8.75 18.25,10 23.25,10 23.75,9.5 26.25,9.5 v28,7.75
TX_MISO  (via drill 0.38)  (1 unrouted)
  Top 0.2: IC7.9 17.33,13.67 17.5,13.5 17.5,12.25 18.75,11 24.25,11 v24.5,10.75 | v26,12.5 26,16 27.25,17.25
  Bottom 0.2: v24.5,10.75 24.5,11 v26,12.5
TX_MOSI  (via drill 0.38)  (1 unrouted)
  Top 0.2: 27.2,14.7 26.75,14.25 26.75,12.5 v27,12.25 | v25.75,10.25 25.5,10.25 25.25,10 24,10 23.5,10.5 18.5,10.5 17,12 15,12 14.68,12.32 IC7.7
  Bottom 0.2: v27,12.25 27,11.5 v25.75,10.25
TX_RST  (3 unrouted)
  Top 0.2: IC7.2 12.19,8 | 12.19,8 12.19,7.07 | R6.1 9.75,8.25 10,8 12.19,8
  Bottom 0.2: 16.75,8.5 16.75,9 18.5,10.75 23.25,10.75 24.75,9.25 26,9.25 27.5,10.75 27.5,11.25
WDT_ERR  (1 unrouted)
WDT_PA_EN  (2 unrouted)